# EAGLE design GSM (EAGLE 5.11)
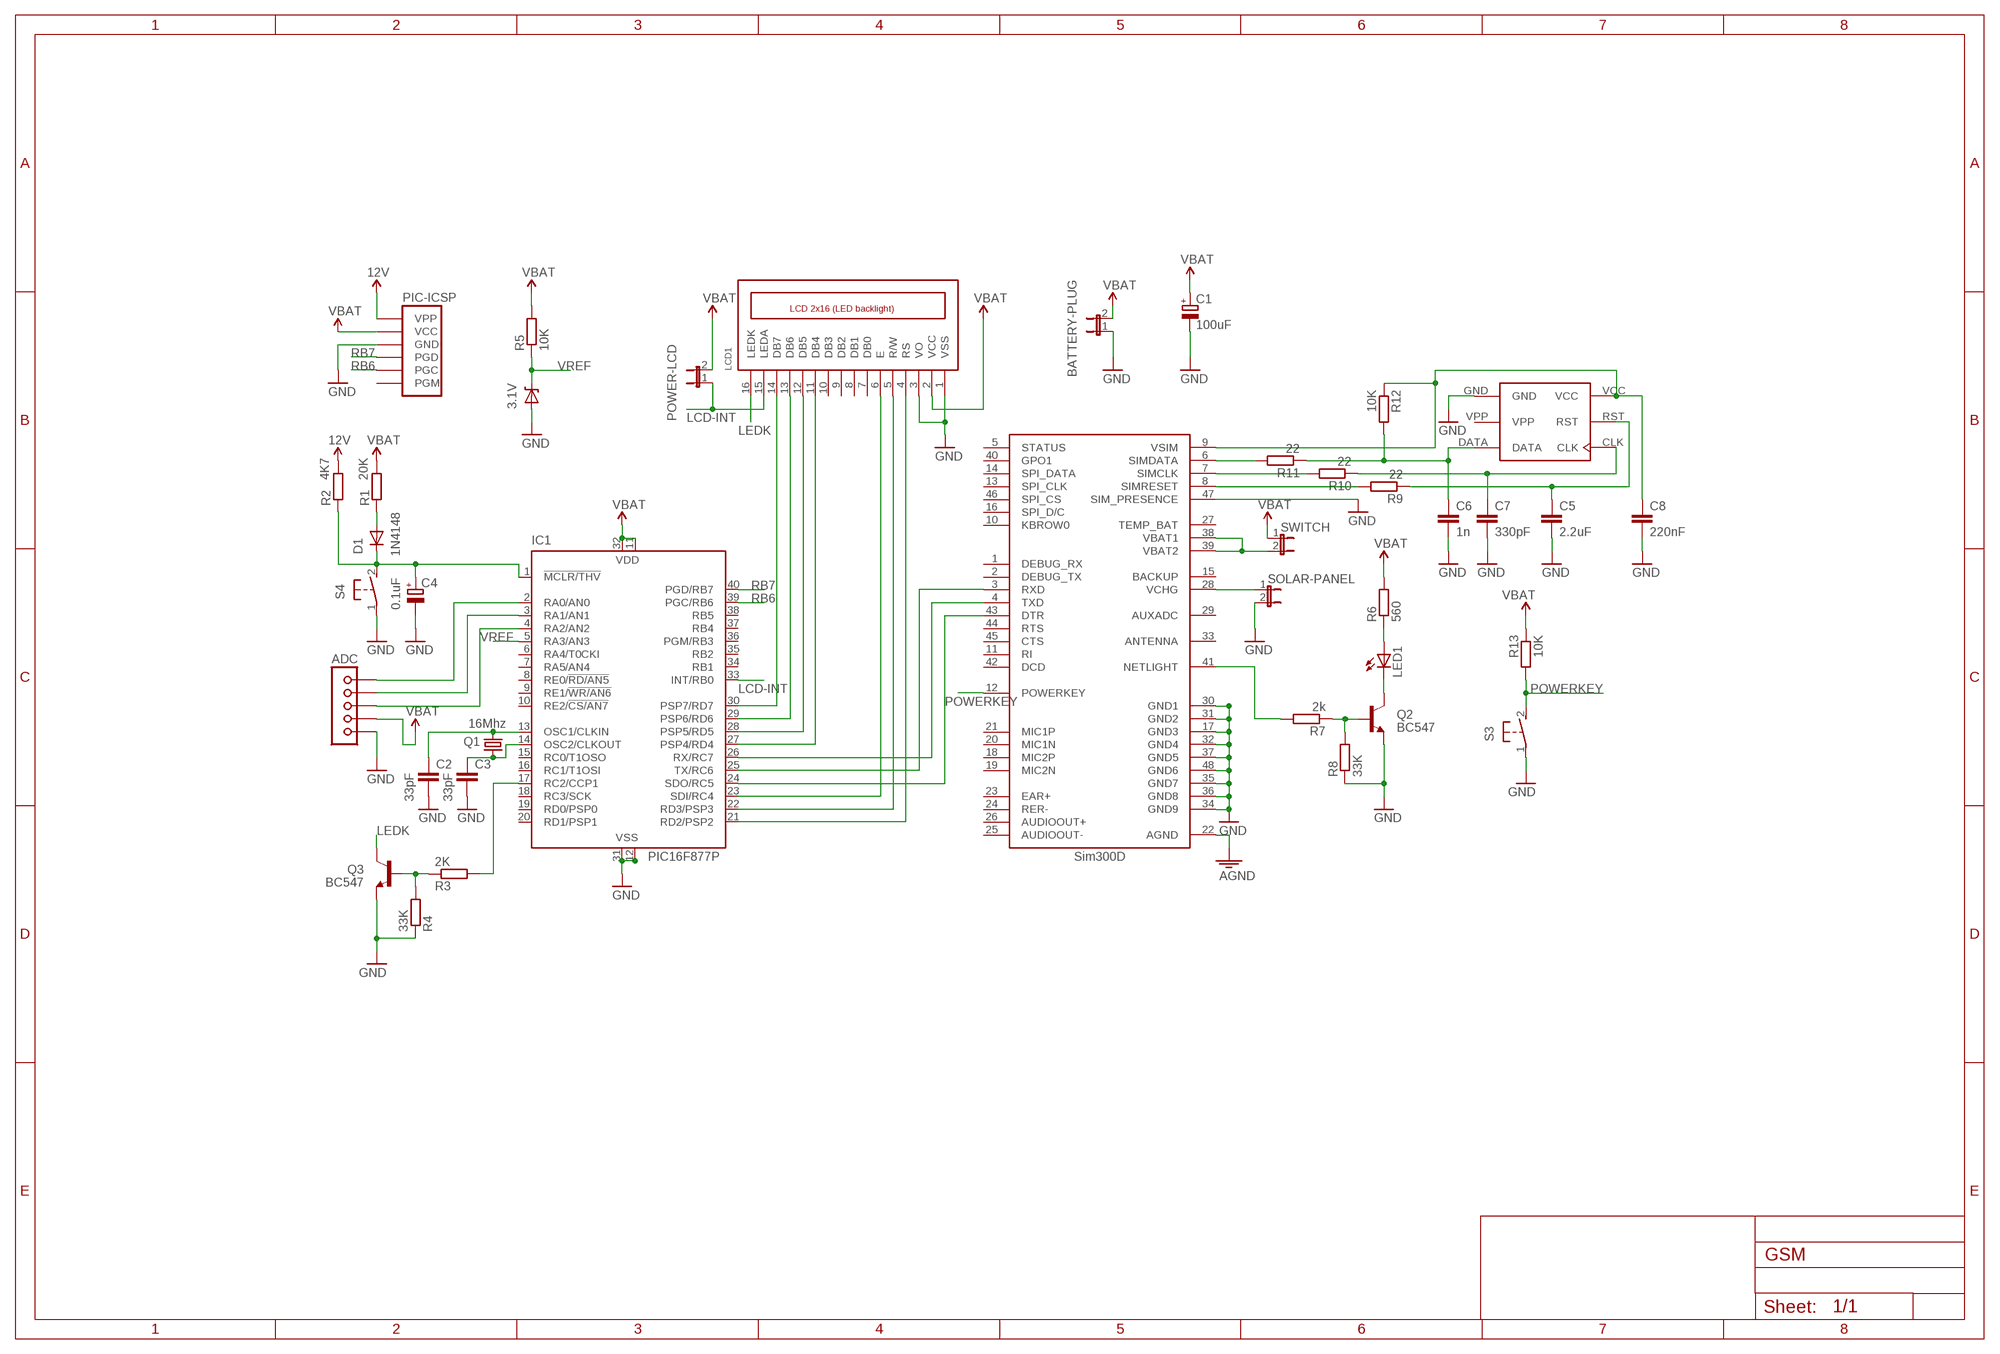
[diagram p0: schematic, sheet 1]

## Parts
3.1V  DIODE-ZENERPTH  [DIODE-ZENER]
ADC  KLEMES  [KLEMES]
BATTERY-PLUG  JP1E  [JP1]
C1  100uF  CPOL-EUE2.5-7  [E2,5-7]
C2  33pF  C-EU025-025X050  [C025-025X050]
C3  33pF  C-EU025-025X050  [C025-025X050]
C4  0.1uF  CPOL-EUE2-5  [E2-5]
C5  2.2uF  C-EU025-025X050  [C025-025X050]
C6  1n  C-EU025-025X050  [C025-025X050]
C7  330pF  C-EU025-025X050  [C025-025X050]
C8  220nF  C-EU025-025X050  [C025-025X050]
D1  1N4148  DIODE1N4148  [DIODE-1N4148]
IC1  PIC16F877P  [DIL40]
LCD1  LCD_2X16_SIL  [HY-1602F]
LED1  LEDSFH482  [SFH482]
PIC-ICSP  PIC-ICSP  [PIC-ICSP]
POWER-LCD  JP1E  [JP1]
Q1  16Mhz  CRYSTALHC49US  [HC49US]
Q2  BC547  TRANSISTOR_NPNSOT23  [SOT23]
Q3  BC547  TRANSISTOR_NPNSOT23  [SOT23]
R1  20K  R-EU_0207/12  [0207/12]
R2  4K7  R-EU_0207/12  [0207/12]
R3  2K  R-EU_0207/12  [0207/12]
R4  33K  R-EU_0207/12  [0207/12]
R5  10K  R-EU_0207/12  [0207/12]
R6  560  R-EU_0207/12  [0207/12]
R7  2k  R-EU_0207/12  [0207/12]
R8  33K  R-EU_0207/12  [0207/12]
R9  22  R-EU_0207/12  [0207/12]
R10  22  R-EU_0207/12  [0207/12]
R11  22  R-EU_0207/12  [0207/12]
R12  10K  R-EU_0207/12  [0207/12]
R13  10K  R-EU_0207/12  [0207/12]
S3  31-XX  [B3F-31XX]
S4  31-XX  [B3F-31XX]
SOLAR-PANEL  JP1E  [JP1]
SWITCH  JP1E  [JP1]
U$1  SIM300D  [SIM300D]
U$4  SIM-HOLDER  [SIM-HOLDER]

## Nets
12V: PIC-ICSP.P$12(VPP) R2.2
GND: 3.1V.P$2(A) ADC.P$10 BATTERY-PLUG.1 C1.- C2.2 C3.2 C4.- C5.2 C6.2 C7.2 C8.2 IC1.12(VSS) IC1.31(VSS) LCD1.1(VSS) LCD1.3(VO) PIC-ICSP.P$7(GND) Q2.2(E) Q3.2(E) R4.1 R8.1 S3.1(P) S4.1(P) SOLAR-PANEL.2 U$1.17(GND3) U$1.22(AGND) U$1.30(GND1) U$1.31(GND2) U$1.32(GND4) U$1.34(GND9) U$1.35(GND7) U$1.36(GND8) U$1.37(GND5) U$1.47(SIM_PRESENCE) U$1.48(GND6) U$4.GND ; supply symbol labelled AGND
LCD-INT: IC1.33(INT/RB0) LCD1.15(LEDA) POWER-LCD.1
LEDK: LCD1.16(LEDK) Q3.3(C)
N$1: IC1.30(PSP7/RD7) LCD1.14(DB7)
N$2: IC1.29(PSP6/RD6) LCD1.13(DB6)
N$3: SOLAR-PANEL.1 U$1.28(VCHG)
N$4: D1.A R1.1
N$5: C2.1 IC1.13(OSC1/CLKIN) Q1.2
N$6: C3.1 IC1.14(OSC2/CLKOUT) Q1.1
N$7: IC1.26(RX/RC7) U$1.4(TXD)
N$8: C4.+ D1.C IC1.1(!MCLR/THV) R2.1 S4.2(S)
N$9: R10.2 U$1.7(SIMCLK)
N$10: C5.1 R9.1 U$4.RST
N$11: R11.2 U$1.6(SIMDATA)
N$12: C7.1 R10.1 U$4.CLK
N$14: Q2.1(B) R7.1 R8.2
N$15: LED1.K(C) Q2.3(C)
N$16: LED1.A R6.1
N$17: IC1.28(PSP5/RD5) LCD1.12(DB5)
N$18: IC1.27(PSP4/RD4) LCD1.11(DB4)
N$19: IC1.23(SDI/RC4) LCD1.6(E)
N$20: IC1.21(RD2/PSP2) LCD1.4(RS)
N$21: R7.2 U$1.41(NETLIGHT)
N$22: C6.1 R11.1 R12.2 U$4.DATA
N$23: C8.1 R12.1 U$1.9(VSIM) U$4.VCC
N$24: R9.2 U$1.8(SIMRESET)
N$25: IC1.22(RD3/PSP3) LCD1.5(R/W)
N$26: IC1.25(TX/RC6) U$1.3(RXD)
N$27: ADC.P$6 IC1.2(RA0/AN0)
N$28: ADC.P$7 IC1.3(RA1/AN1)
N$29: ADC.P$8 IC1.4(RA2/AN2)
N$30: IC1.24(SDO/RC5) U$1.43(DTR)
N$31: IC1.17(RC2/CCP1) R3.2
N$32: Q3.1(B) R3.1 R4.2
N$33: SWITCH.2 U$1.38(VBAT1) U$1.39(VBAT2)
POWERKEY: R13.2 S3.2(S) U$1.12(POWERKEY)
RB6: IC1.39(PGC/RB6) PIC-ICSP.P$8(PGC)
RB7: IC1.40(PGD/RB7) PIC-ICSP.P$9(PGD)
VBAT: ADC.P$9 BATTERY-PLUG.2 C1.+ IC1.11(VDD) IC1.32(VDD) LCD1.2(VCC) PIC-ICSP.P$11(VCC) POWER-LCD.2 R1.2 R5.2 R6.2 R13.1 SWITCH.1
VREF: 3.1V.P$1(C) IC1.5(RA3/AN3) R5.1
Unconnected: IC1.6(RA4/T0CKI) IC1.7(RA5/AN4) IC1.8(RE0/!RD/AN5) IC1.9(RE1/!WR/AN6) IC1.10(RE2/!CS/AN7) IC1.15(RC0/T1OSO) IC1.16(RC1/T1OSI) IC1.18(RC3/SCK) IC1.19(RD0/PSP0) IC1.20(RD1/PSP1) IC1.34(RB1) IC1.35(RB2) IC1.36(PGM/RB3) IC1.37(RB4) IC1.38(RB5) LCD1.7(DB0) LCD1.8(DB1) LCD1.9(DB2) LCD1.10(DB3) PIC-ICSP.P$10(PGM) U$1.1(DEBUG_RX) U$1.2(DEBUG_TX) U$1.5(STATUS) U$1.10(KBROW0) U$1.11(RI) U$1.13(SPI_CLK) U$1.14(SPI_DATA) U$1.15(BACKUP) U$1.16(SPI_D/C) U$1.18(MIC2P) U$1.19(MIC2N) U$1.20(MIC1N) U$1.21(MIC1P) U$1.23(EAR+) U$1.24(RER-) U$1.25(AUDIOOUT-) U$1.26(AUDIOOUT+) U$1.27(TEMP_BAT) U$1.29(AUXADC) U$1.33(ANTENNA) U$1.40(GPO1) U$1.42(DCD) U$1.44(RTS) U$1.45(CTS) U$1.46(SPI_CS)

## Power pins joined to a net without a drawn wire
VPP: U$4.VPP

## Library data of the parts
3.1V = SparkFun:DIODE-ZENER: Zener Diode Production Part - 8199 3.4V Zener Voltage
ADC = candrian:KLEMES
BATTERY-PLUG POWER-LCD SOLAR-PANEL SWITCH = jumper:JP1E: JUMPER
C1 C4 = rcl:CPOL-EU: POLARIZED CAPACITOR, European symbol
C2 C3 C5-C8 = rcl:C-EU: CAPACITOR, European symbol
D1 = SparkFun:DIODE: Diode These are standard reverse protection diodes and small signal diodes. SMA package can handle up to about 1A. SOD-323 can handle about 200mA. What the SOD-323 package when ordering, there are some mfgs out there that are 5-pin packages.
IC1 = microchip:PIC16F87*: MICROCONTROLLER; MF: MICROCHIP; MPN: PIC16F877-04/P; OC_FARNELL: 9761349; OC_NEWARK: 61K3463
LCD1 = lcd_2x16_led_backlight:LCD_2X16_SIL
LED1 = led:LED: LED OSRAM: - CHIPLED LG R971, LG N971, LY N971, LG Q971, LY Q971, LO R971, LY R971 LH N974, LH R974 LS Q976, LO Q976, LY Q976 LO Q996 - Hyper CHIPLED LW Q18S LB Q993, LB Q99A, LB R99A - SideLED LS A670, LO A670, LY A670, LG A670, LP A670 LB A673, LV A673, LT A673, LW A673 LH A674 LY A675 LS A676, LA A676, LO A676, LY A676, LW A676 LS A679, LY A679, LG A679 - Hyper Micro SIDELED® LS Y876, LA Y876, LO Y876, LY Y876 LT Y87S - SmartLED LW L88C, LW L88S LB L89C, LB L89S, LG L890 LS L89K, LO L89K, LY L89K LS L896, LA L896, LO L896, LY L896 - TOPLED LS T670, LO T670, LY T670, LG T670, LP T670 LSG T670, LSP T670, LSY T670, LOP T670, LYG T670 LG T671, LOG T671, LSG T671 LB T673, LV T673, LT T673, LW T673 LH T674 LS T676, LA T676, LO T676, LY T676, LB T676, LH T676, LSB T676, LW T676 LB T67C, LV T67C, LT T67C, LS T67K, LO T67K, LY T67K, LW E67C LS E67B, LA E67B, LO E67B, LY E67B, LB E67C, LV E67C, LT E67C LW T67C LS T679, LY T679, LG T679 LS T770, LO T770, LY T770, LG T770, LP T770 LB T773, LV T773, LT T773, LW T773 LH T774 LS E675, LA E675, LY E675, LS T675 LS T776, LA T776, LO T776, LY T776, LB T776 LHGB T686 LT T68C, LB T68C - Hyper Mini TOPLED® LB M676 - Mini TOPLED Santana® LG M470 LS M47K, LO M47K, LY M47K Source: http://www.osram.convergy.de LUXEON: - LUMILED® LXK2-PW12-R00, LXK2-PW12-S00, LXK2-PW14-U00, LXK2-PW14-V00 LXK2-PM12-R00, LXK2-PM12-S00, LXK2-PM14-U00 LXK2-PE12-Q00, LXK2-PE12-R00, LXK2-PE12-S00, LXK2-PE14-T00, LXK2-PE14-U00 LXK2-PB12-K00, LXK2-PB12-L00, LXK2-PB12-M00, LXK2-PB14-N00, LXK2-PB14-P00, LXK2-PB14-Q00 LXK2-PR12-L00, LXK2-PR12-M00, LXK2-PR14-Q00, LXK2-PR14-R00 LXK2-PD12-Q00, LXK2-PD12-R00, LXK2-PD12-S00 LXK2-PH12-R00, LXK2-PH12-S00 LXK2-PL12-P00, LXK2-PL12-Q00, LXK2-PL12-R00 Source: www.luxeon.com KINGBRIGHT: KA-3528ASYC Source: www.kingbright.com
PIC-ICSP = Andrianakis:PIC-ICSP
Q1 = SparkFun:CRYSTAL: Crystals Various standard crystals. Proven footprints. Spark Fun Electronics SKU : COM-00534
Q2 Q3 = SparkFun:TRANSISTOR_NPN: Transistor NPN BJT configuration in SOT23 package. MMBT2222 is the common NPN we use. Double check BCE configuration again layout.
R1-R13 = rcl:R-EU_: RESISTOR, European symbol
S3 S4 = switch-omron:31-XX: OMRON SWITCH; MPN: B3F-3100; OC_FARNELL: 959704; OC_NEWARK: 36M3582
U$1 = Andrianakis:SIM300D: Designed by Andrianakis Charalampos email: microtro@gmail.com
U$4 = Andrianakis:SIM-HOLDER

## Board
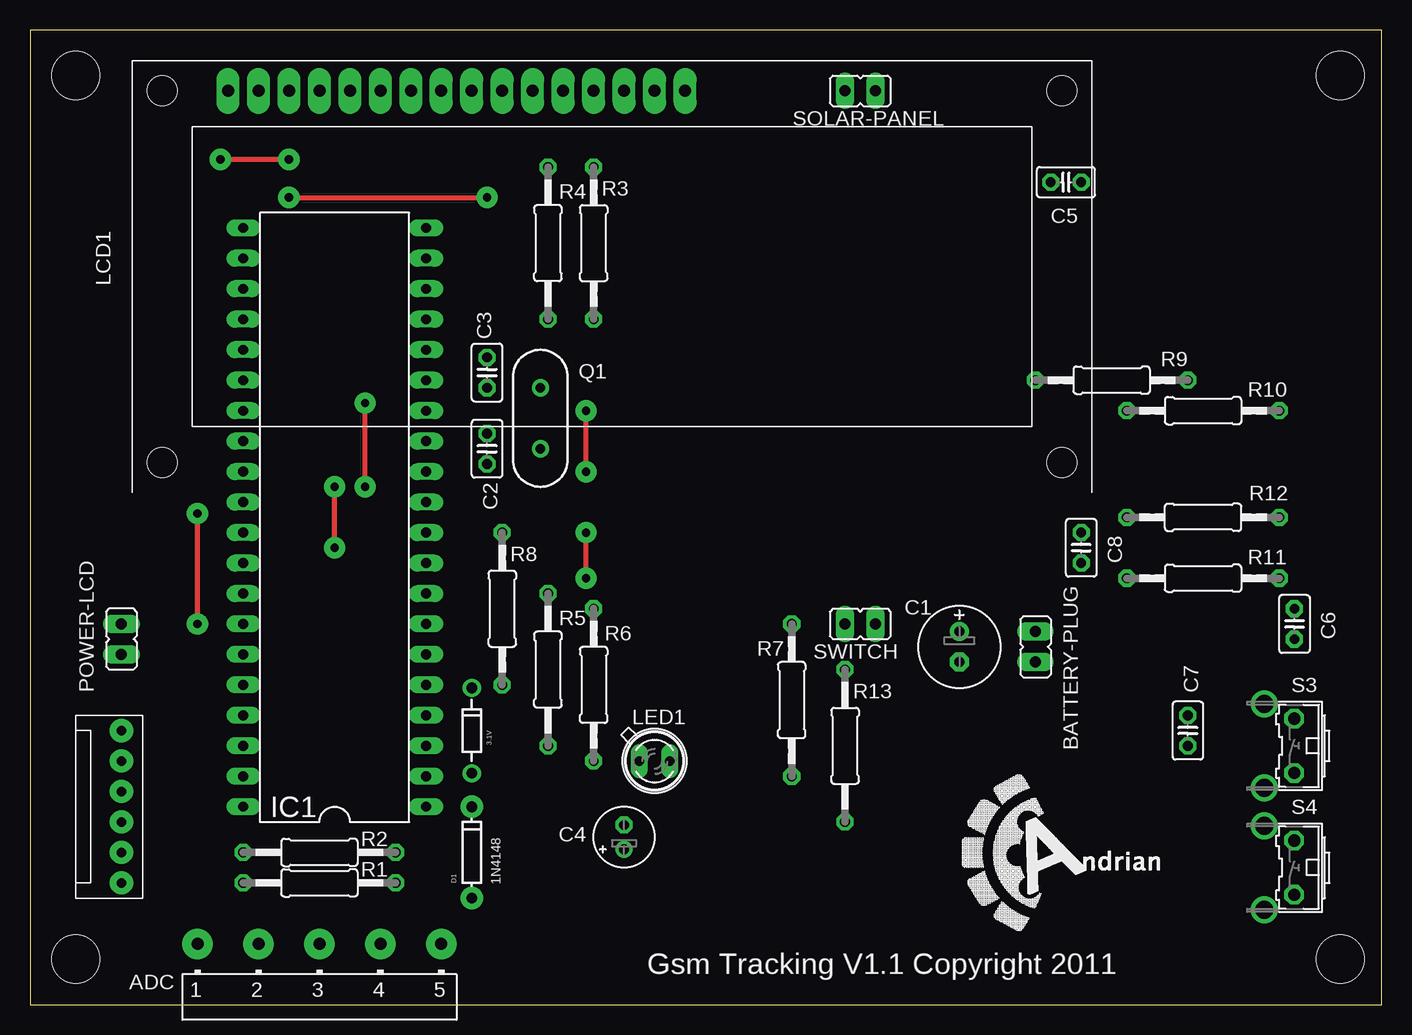
[diagram p1: board, top side]
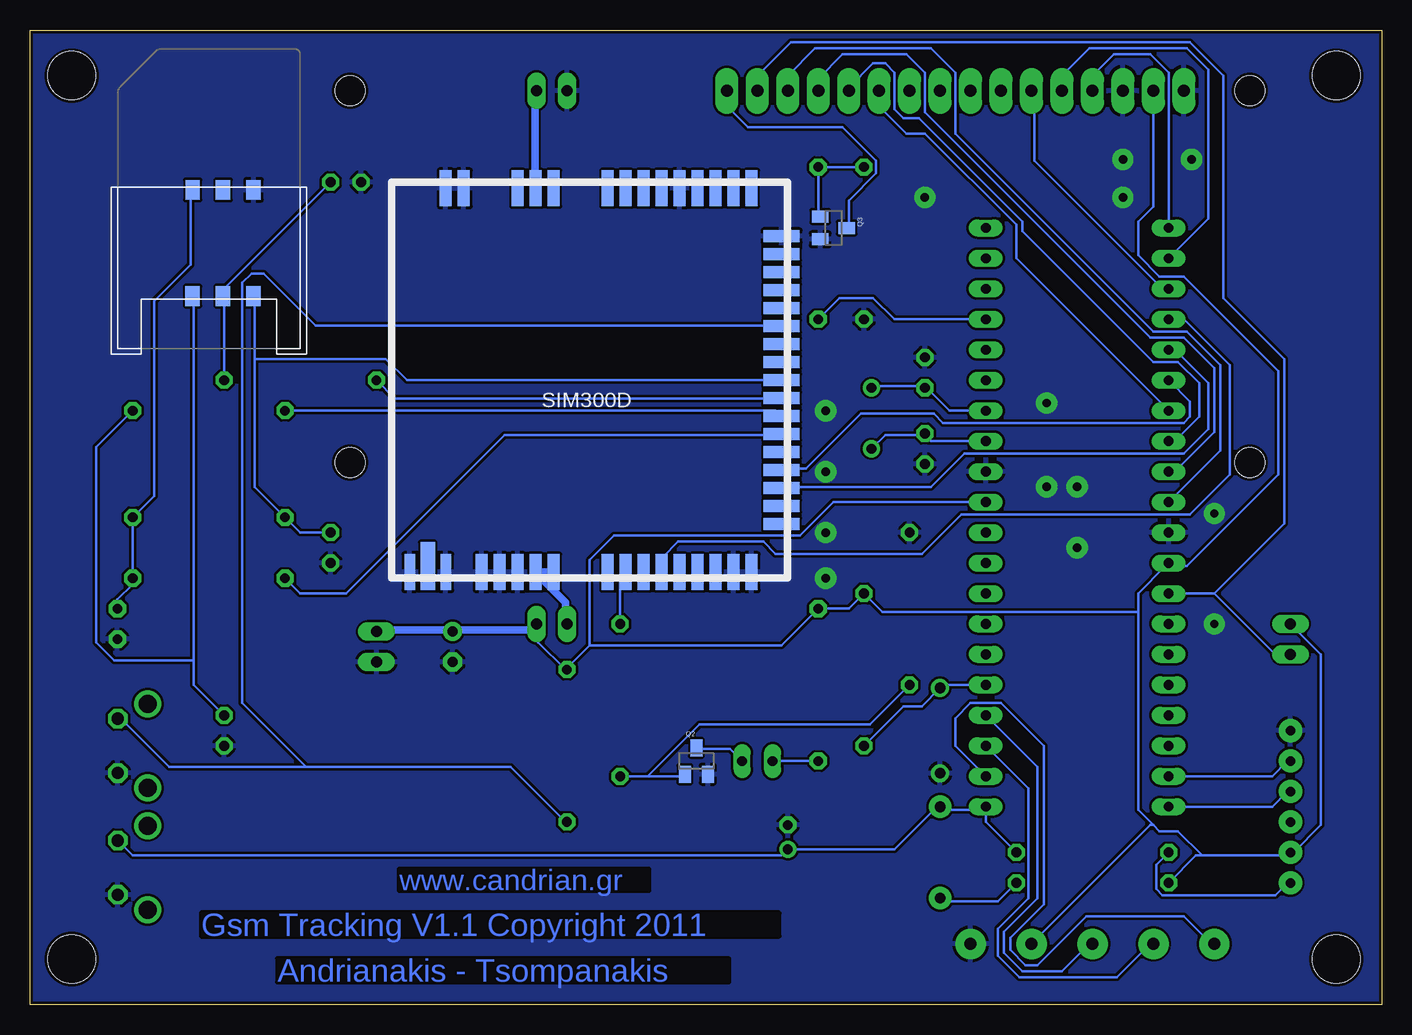
[diagram p2: board, bottom side, seen from below]

Size 112.7 x 81.27 mm. Coordinates in mm from the lower left corner, seen from the top.
Outline: 0,0 112.7,0 112.7,81.27 0,81.27 0,0
Copper layers (1*16): Top 0.035mm / dielectric 1.5mm / Bottom 0.035mm
Design rules "SparkFun": minimum track width 8mil, minimum drill 20mil, track to track 8mil, track to pad 8mil, pad to pad 8mil, via to via 8mil, smd to smd 8mil, copper to edge 10mil, drill to drill 8mil, minimum pad ring 12mil, minimum via ring 10mil, stop-mask expansion 4mil, vias tented up to drill 25mil, thermal gap 10mil
Holes 4 mm at 3.81,77.47 3.81,3.81 109.22,77.47 109.22,3.81

### Footprints (pad centres in the part's own frame; a part is rotated, then mirrored left to right if it is on the bottom)
DIODE-ZENER = drill 0.9 round: P$1 -3.556,0; P$2 3.556,0
KLEMES = drill 1 pad 2.54 round: P$6 -10.16,1.27; P$7 -5.08,1.27; P$8 0,1.27; P$9 5.08,1.27; P$10 10.16,1.27
JP1 = drill 0.914 long: 1 0,-1.27; 2 0,1.27
E2,5-7 = drill 0.813 pad 1.6 round: + -1.27,0 | drill 0.813 pad 1.6 octagon: - 1.27,0
C025-025X050 = drill 0.813 octagon: 1 -1.27,0; 2 1.27,0
E2-5 = drill 0.813 pad 1.27 round: + -1.016,0 | drill 0.813 pad 1.27 octagon: - 1.016,0
DIODE-1N4148 = drill 0.9 pad 1.88 round: A -3.81,0; C 3.81,0
DIL40 = drill 0.813 long: 1 -24.13,-7.62; 2 -21.59,-7.62; 3 -19.05,-7.62; 4 -16.51,-7.62; 5 -13.97,-7.62; 6 -11.43,-7.62; 7 -8.89,-7.62; 8 -6.35,-7.62; 9 -3.81,-7.62; 10 -1.27,-7.62; 11 1.27,-7.62; 12 3.81,-7.62; 13 6.35,-7.62; 14 8.89,-7.62; 15 11.43,-7.62; 16 13.97,-7.62; 17 16.51,-7.62; 18 19.05,-7.62; 19 21.59,-7.62; 20 24.13,-7.62; 21 24.13,7.62; 22 21.59,7.62; 23 19.05,7.62; 24 16.51,7.62; 25 13.97,7.62; 26 11.43,7.62; 27 8.89,7.62; 28 6.35,7.62; 29 3.81,7.62; 30 1.27,7.62; 31 -1.27,7.62; 32 -3.81,7.62; 33 -6.35,7.62; 34 -8.89,7.62; 35 -11.43,7.62; 36 -13.97,7.62; 37 -16.51,7.62; 38 -19.05,7.62; 39 -21.59,7.62; 40 -24.13,7.62
HY-1602F = drill 1 pad 1.93 long: 1 2.54,0; 2 5.08,0; 3 7.62,0; 4 10.16,0; 5 12.7,0; 6 15.24,0; 7 17.78,0; 8 20.32,0; 9 22.86,0; 10 25.4,0; 11 27.94,0; 12 30.48,0; 13 33.02,0; 14 35.56,0; 15 38.1,0; 16 40.64,0 | hole 2.5: -2.96,0; 72.04,0; -2.96,-31; 72.04,-31
SFH482 = drill 0.813 long: A -1.27,0; K 1.27,0
PIC-ICSP = drill 0.8 pad 1.93 round: P$7 -6.35,1.27; P$8 -3.81,1.27; P$9 -1.27,1.27; P$10 1.27,1.27; P$11 3.81,1.27; P$12 6.35,1.27
HC49US = drill 0.813 round: 1 -2.54,0; 2 2.54,0
SOT23 = smd 1 x 1.4: 1 -0.95,-1.1; 2 0.95,-1.1; 3 0,1.1
0207/12 = drill 0.813 octagon: 1 -6.35,0; 2 6.35,0
B3F-31XX = drill 1.016 octagon: 1 -2.261,-1.245; 2 2.261,-1.245 | drill 1.499 pad 2.159 round: 3 -3.505,1.245; 4 3.505,1.245
SIM300D = smd 3 x 1: 1 -16,12; 2 -16,10.5; 3 -16,9; 4 -16,7.5; 5 -16,6; 6 -16,4.5; 7 -16,3; 8 -16,1.5; 9 -16,0; 10 -16,-1.5; 11 -16,-3; 12 -16,-4.5; 13 -16,-6; 14 -16,-7.5; 15 -16,-9; 16 -16,-10.5; 17 -16,-12 | smd 1 x 3: 18 -13.5,-16; 19 -12,-16; 20 -10.5,-16; 21 -9,-16; 22 -7.5,-16; 23 -6,-16; 24 -4.5,-16; 25 -3,-16; 26 -1.5,-16; 27 3,-16; 28 4.5,-16; 29 6,-16; 30 10.5,-16; 31 12,-16; 35 9,16; 36 7.5,16; 37 6,16; 38 4.5,16; 39 3,16; 40 -1.5,16; 41 -3,16; 42 -4.5,16; 43 -6,16; 44 -7.5,16; 45 -9,16; 46 -10.5,16; 47 -12,16; 48 -13.5,16 | smd 0.9 x 3: 32 15,16; 34 12,16 | smd 1.2 x 4: 33 13.5,15.5
SIM-HOLDER = smd 1.65 x 1.2: CLK -8.23,2.63; DATA 0.62,2.62; GND 0.62,-2.46; RST -8.23,0.09; VCC -8.23,-2.45; VPP 0.62,0.08

### Placement (x,y rotation side)
3.1V  36.83,22.86 270 top
ADC  24.13,3.81 0 top
BATTERY-PLUG  83.82,29.84 0 top
C1  77.47,29.84 270 top
C2  38.1,46.35 270 top
C3  38.1,52.7 90 top
C4  49.53,13.97 90 top
C5  86.36,68.58 180 top
C6  105.41,31.75 270 top
C7  96.52,22.86 270 top
C8  87.63,38.1 270 top
D1  36.83,12.7 90 top
IC1  25.4,40.64 90 top
LCD1  13.97,76.2 0 top
LED1  52.07,20.32 0 top
PIC-ICSP  6.35,16.51 270 top
POWER-LCD  7.62,30.48 0 top
Q1  42.55,48.9 270 top
Q2  57.15,20.32 0 bottom
Q3  45.72,64.77 270 bottom
R1  24.13,10.16 180 top
R2  24.13,12.7 180 top
R3  46.99,63.5 270 top
R4  43.18,63.5 90 top
R5  43.18,27.94 90 top
R6  46.99,26.67 90 top
R7  63.5,25.4 90 top
R8  39.37,33.02 270 top
R9  90.17,52.07 180 top
R10  97.79,49.53 180 top
R11  97.79,35.56 180 top
R12  97.79,40.64 0 top
R13  67.94,21.59 270 top
S3  104.14,21.59 90 top
S4  104.14,11.43 90 top
SOLAR-PANEL  69.22,76.2 90 top
SWITCH  69.22,31.75 90 top
U$1  66.04,52.07 180 bottom
U$2  [CANDRIAN-LOGO]  86.99,11.43 0 top
U$4  96.52,67.31 90 bottom

### Tracks (layer width: path | path; a pad name or v marks a point on that pad's centre or on a via)
12V
  Bottom 0.203: R2.2 18.8,11.68 18.8,9.65 18.29,9.14 8.89,9.14 7.87,10.16 PIC-ICSP.P$12
GND  (via drill 0.7 pad 1.78)
  Top 0.406: v15.88,70.48 v21.59,70.48 | v21.59,67.31 v38.1,67.31 | v13.97,31.75 v13.97,40.96 | v25.4,38.1 v25.4,43.18 | v46.36,35.56 v46.36,39.37 | v27.94,43.18 v27.94,50.16 | v46.36,44.45 v46.36,49.53
  pour Bottom: 0,81.28 113.03,81.28 113.03,0 0,0
LCD-INT
  Bottom 0.203: 13.97,34.29 IC1.33 | 13.97,34.29 8.89,29.21 POWER-LCD.1 | LCD1.15 52.07,77.47 49.28,80.26 16,80.26 13.21,77.47 13.21,58.93 8.13,53.85 8.13,40.13 13.97,34.29
LEDK
  Bottom 0.203: LCD1.16 54.61,74.93 52.83,73.15 44.96,73.15 42.16,70.36 42.16,69.34 44.45,67.06 44.45,64.77 Q3.3
N$1
  Bottom 0.203: IC1.30 13.46,46.23 13.46,53.34 16.26,56.13 19.05,56.13 35.56,72.64 35.56,77.72 37.59,79.76 47.24,79.76 49.53,77.47 LCD1.14
N$2
  Bottom 0.203: IC1.29 17.27,44.45 13.97,47.75 13.97,53.09 16.51,55.63 19.3,55.63 38.1,74.42 38.1,77.72 39.62,79.25 44.96,79.25 46.99,77.22 LCD1.13
N$3
  Bottom 0.203: U$1.28 70.61,68.07 | 70.61,76.2 SOLAR-PANEL.1
  Bottom 0.61: 70.61,68.07 70.61,76.2
N$4
  Bottom 0.203: R1.1 32,8.64 36.58,8.64 D1.A
N$5
  Bottom 0.203: IC1.13 37.59,46.99 38.1,47.5 | 38.1,47.5 41.4,47.5 Q1.2 | 38.1,47.5 C2.1
N$6
  Bottom 0.203: IC1.14 36.07,49.53 38.1,51.56 | 38.1,51.56 42.42,51.56 Q1.1 | 38.1,51.56 C3.1
N$7
  Bottom 0.203: IC1.26 16,50.29 16,49.02 16.51,48.51 36.58,48.51 37.34,49.28 43.43,49.28 48.01,44.7 50.04,44.7 U$1.4
N$8
  Bottom 0.203: R2.1 33.02,15.24 33.02,16.26 | 37.34,16.26 37.08,16.51 D1.C 37.34,16.26 | 37.34,16.26 40.64,12.95 C4.+ 50.04,12.45 104.14,12.45 S4.2 | 33.02,16.26 37.34,16.26 | 33.02,16.26 IC1.1
N$9
  Bottom 0.203: R10.2 50.55,49.53 50.29,49.28 U$1.7
N$10
  Bottom 0.203: R9.1 96.52,58.93 U$4.RST 96.52,59.18 96.52,59.69 C5.1
N$11
  Bottom 0.203: R11.2 90.17,34.29 86.36,34.29 73.15,47.5 50.29,47.5 U$1.6
N$12
  Bottom 0.203: 99.06,28.7 99.06,26.67 C7.1 | 99.06,28.7 99.06,58.93 U$4.CLK | R10.1 107.19,46.48 107.19,30.23 105.66,28.7 99.06,28.7
N$14
  Bottom 0.203: 61.21,19.05 R7.1 | 61.21,19.05 58.17,19.05 Q2.1 | R8.2 42.67,23.37 56.9,23.37 61.21,19.05
N$15
  Bottom 0.203: LED1.K 54.36,21.34 57.15,21.34 Q2.3
N$16
  Bottom 0.203: R6.1 LED1.A
N$17
  Bottom 0.203: IC1.28 17.27,46.99 15.24,49.02 15.24,51.82 17.02,53.59 19.05,53.59 29.97,64.52 29.97,65.28 38.61,73.91 39.88,73.91 40.64,74.68 40.64,77.72 41.4,78.49 42.42,78.49 44.45,76.45 LCD1.12
N$18
  Bottom 0.203: IC1.27 30.48,62.23 30.48,65.02 38.1,72.64 39.62,72.64 41.91,74.93 LCD1.11
N$19
  Bottom 0.203: IC1.23 18.29,59.69 28.96,70.36 28.96,75.95 LCD1.6
N$20
  Bottom 0.203: IC1.21 17.78,77.72 19.3,79.25 22.35,79.25 24.13,77.47 LCD1.4
N$21
  Bottom 0.203: R7.2 63.5,35.81 63.25,36.07 U$1.41
N$22
  Bottom 0.203: C6.1 105.41,33.78 104.14,35.05 R11.1 R12.2 102.36,42.42 102.36,58.67 99.31,61.72 99.31,67.82 U$4.DATA
N$23
  Bottom 0.203: 93.98,53.85 93.98,43.18 R12.1 90.17,39.37 C8.1 | 93.98,53.85 93.98,58.93 U$4.VCC | 93.98,53.85 83.06,53.85 81.28,52.07 U$1.9
N$24
  Bottom 0.203: R9.2 82.3,50.55 50.29,50.55 U$1.8
N$25
  Bottom 0.203: IC1.22 14.48,65.53 14.48,77.98 16.26,79.76 24.38,79.76 26.67,77.47 LCD1.5
N$26
  Bottom 0.203: IC1.25 17.27,54.61 14.48,51.82 14.48,48.01 16.51,45.97 34.8,45.97 37.59,43.18 50.04,43.18 U$1.3
N$27
  Bottom 0.203: IC1.2 35.56,21.59 35.56,23.88 34.29,25.15 31.75,25.15 28.19,21.59 28.19,8.38 30.99,5.59 30.99,4.57 29.72,3.3 28.7,3.3 24.64,7.37 16.51,7.37 14.22,5.08 ADC.P$6
N$28
  Bottom 0.203: IC1.3 29.46,18.03 29.46,8.89 32,6.35 32,4.06 30.23,2.29 22.1,2.29 19.3,5.08 ADC.P$7
N$29
  Bottom 0.203: IC1.4 28.7,19.81 28.7,8.89 31.5,6.1 31.5,4.32 29.97,2.79 26.67,2.79 24.38,5.08 ADC.P$8
N$30
  Bottom 0.203: IC1.24 16.51,57.15 12.7,53.34 12.7,44.2 16,40.89 35.05,40.89 38.35,37.59 50.55,37.59 51.56,38.61 58.67,38.61 59.94,37.34 59.94,36.32 U$1.43
N$31
  Bottom 0.203: IC1.17 40.64,57.15 42.42,58.93 45.21,58.93 R3.2
N$32
  Bottom 0.203: Q3.1 46.99,65.79 R3.1 R4.2
N$33
  Bottom 0.203: 69.09,36.07 U$1.39 | 70.36,36.07 U$1.38 70.61,36.07 | SWITCH.2 68.07,31.75
  Bottom 0.61: 70.36,36.07 69.09,36.07 | 68.07,31.75 68.07,33.53 70.61,36.07
POWERKEY
  Bottom 0.203: 89.66,19.81 101.09,19.81 105.16,23.88 S3.2 | 89.66,19.81 72.64,19.81 68.07,15.24 R13.2 | 89.66,19.81 95,25.15 95,60.2 94.23,60.96 93.22,60.96 88.9,56.64 50.29,56.64 U$1.12
RB6
  Bottom 0.203: IC1.39 9.14,19.05 7.87,20.32 PIC-ICSP.P$8
RB7
  Bottom 0.203: IC1.40 9.14,16.51 7.87,17.78 PIC-ICSP.P$9
VBAT
  Bottom 0.203: 83.82,31.24 BATTERY-PLUG.2 | 68.07,27.94 70.36,30.23 70.36,31.24 | 70.36,31.24 70.36,31.75 SWITCH.1 70.36,31.24 | IC1.11 45.72,41.91 48.51,39.12 64.01,39.12 66.04,37.08 66.04,29.97 | 66.04,29.97 68.07,27.94 | 68.07,27.94 R13.1 | 66.04,29.97 50.04,29.97 R6.2 44.45,33.02 R5.2 41.66,32.77 20.32,32.77 | 77.47,31.24 C1.+ | R1.2 15.49,12.45 14.99,12.45 | 14.99,12.45 7.87,12.45 PIC-ICSP.P$11 7.37,12.7 5.08,14.99 5.08,29.21 POWER-LCD.2 | 18.03,36.58 20.32,34.29 20.32,32.77 | 20.32,32.77 20.32,16.26 19.05,14.99 | 19.05,14.99 18.54,14.48 17.02,14.48 14.99,12.45 | LCD1.2 19.05,66.55 20.32,65.28 20.32,62.48 18.54,60.71 16.51,60.71 8.64,52.83 8.64,44.2 16.26,36.58 18.03,36.58 | 18.03,36.58 IC1.32 | ADC.P$9 19.3,14.99 19.05,14.99
  Bottom 0.61: 83.82,31.24 77.47,31.24 70.36,31.24
VREF
  Bottom 0.203: IC1.5 36.58,26.67 3.1V.P$1 38.35,24.89 39.88,24.89 R5.1

### Text on the board
Bottom: www.candrian.gr | Gsm Tracking V1.1 Copyright 2011 | Andrianakis - Tsompanakis
tNames: Gsm Tracking V1.1 Copyright 2011